# Altium schematic sheet 10_FPGA_misc.SchDoc: FPGA misc (power, clocks, config)
size A3; Organization: Lime Microsystems; Address1: Surrey Tech Centre; Address2: Guildford GU2 7YG; Address3: Surrey; Address4: United Kingdom; Revision: v1.4; SheetNumber: 10; SheetTotal: 15
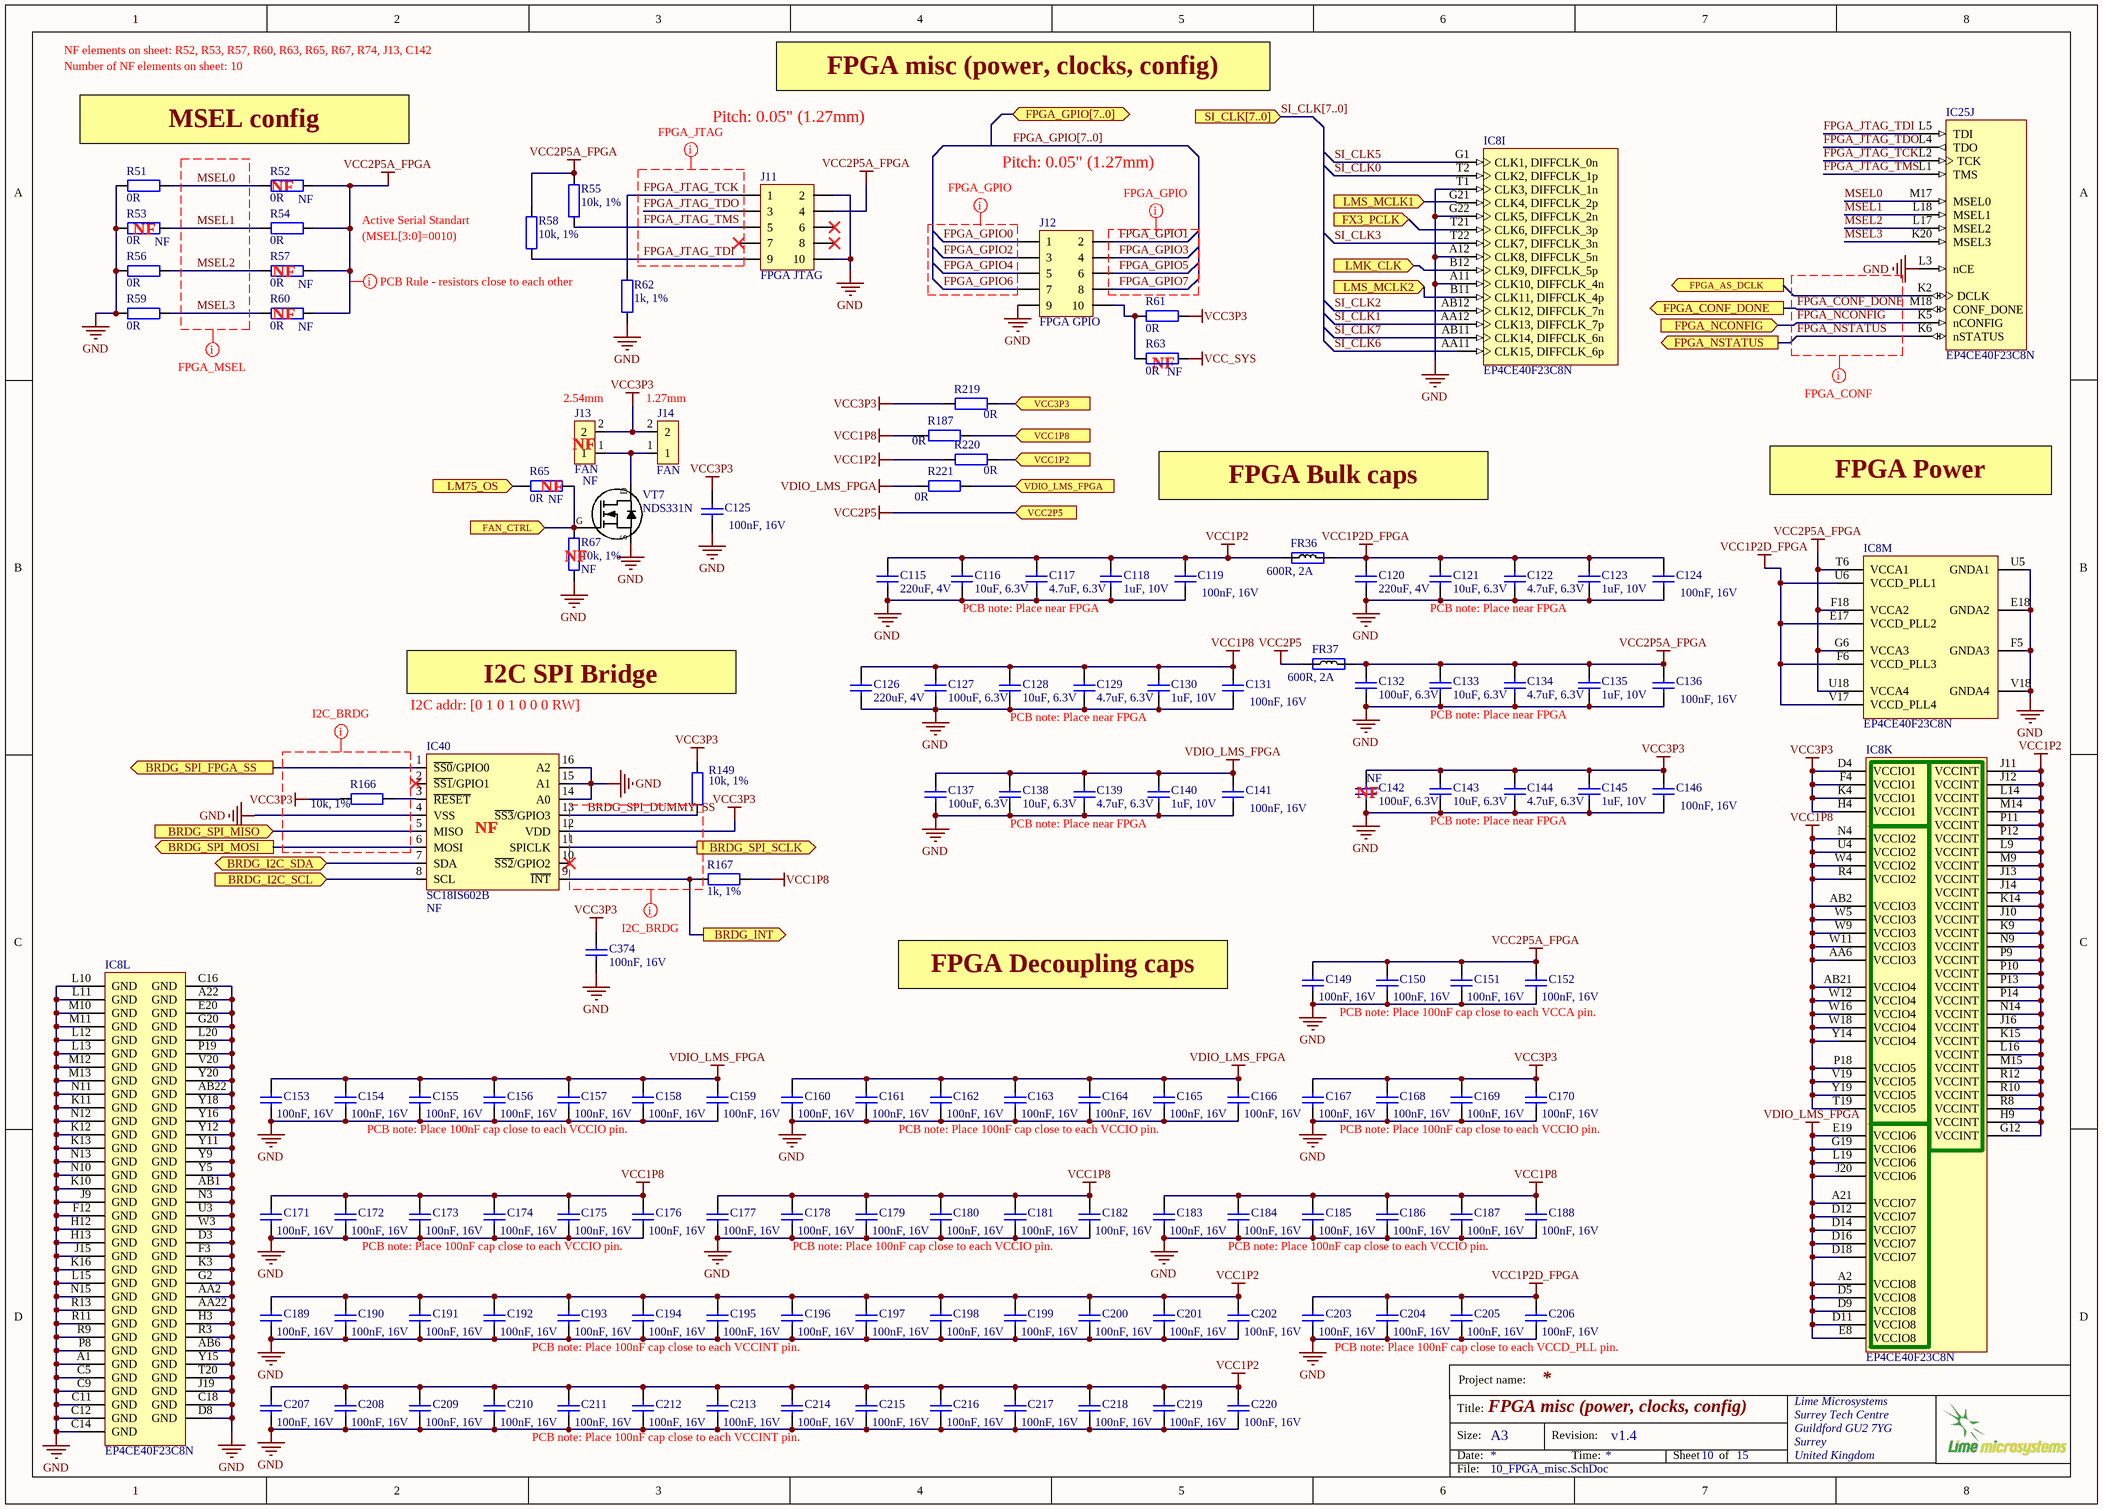
[diagram p0: 10_FPGA_misc.SchDoc]

## Parts
C115  220uF, 4V  [CAP1206]
C116  10uF, 6.3V  [CAP0603]
C117  4.7uF, 6.3V  [CAP0402]
C118  1uF, 10V  [CAP0402]
C119  100nF, 16V  [CAP0402]
C120  220uF, 4V  [CAP1206]
C121  10uF, 6.3V  [CAP0603]
C122  4.7uF, 6.3V  [CAP0402]
C123  1uF, 10V  [CAP0402]
C124  100nF, 16V  [CAP0402]
C125  100nF, 16V  [CAP0402]
C126  220uF, 4V  [CAP1206]
C127  100uF, 6.3V  [CAP1206]
C128  10uF, 6.3V  [CAP0603]
C129  4.7uF, 6.3V  [CAP0402]
C130  1uF, 10V  [CAP0402]
C131  100nF, 16V  [CAP0402]
C132  100uF, 6.3V  [CAP1206]
C133  10uF, 6.3V  [CAP0603]
C134  4.7uF, 6.3V  [CAP0402]
C135  1uF, 10V  [CAP0402]
C136  100nF, 16V  [CAP0402]
C137  100uF, 6.3V  [CAP1206]
C138  10uF, 6.3V  [CAP0603]
C139  4.7uF, 6.3V  [CAP0402]
C140  1uF, 10V  [CAP0402]
C141  100nF, 16V  [CAP0402]
C142  100uF, 6.3V  Assembly Info: NF  [CAP1206]
C143  10uF, 6.3V  [CAP0603]
C144  4.7uF, 6.3V  [CAP0402]
C145  1uF, 10V  [CAP0402]
C146  100nF, 16V  [CAP0402]
C149  100nF, 16V  [CAP0402]
C150  100nF, 16V  [CAP0402]
C151  100nF, 16V  [CAP0402]
C152  100nF, 16V  [CAP0402]
C153  100nF, 16V  [CAP0402]
C154  100nF, 16V  [CAP0402]
C155  100nF, 16V  [CAP0402]
C156  100nF, 16V  [CAP0402]
C157  100nF, 16V  [CAP0402]
C158  100nF, 16V  [CAP0402]
C159  100nF, 16V  [CAP0402]
C160  100nF, 16V  [CAP0402]
C161  100nF, 16V  [CAP0402]
C162  100nF, 16V  [CAP0402]
C163  100nF, 16V  [CAP0402]
C164  100nF, 16V  [CAP0402]
C165  100nF, 16V  [CAP0402]
C166  100nF, 16V  [CAP0402]
C167  100nF, 16V  [CAP0402]
C168  100nF, 16V  [CAP0402]
C169  100nF, 16V  [CAP0402]
C170  100nF, 16V  [CAP0402]
C171  100nF, 16V  [CAP0402]
C172  100nF, 16V  [CAP0402]
C173  100nF, 16V  [CAP0402]
C174  100nF, 16V  [CAP0402]
C175  100nF, 16V  [CAP0402]
C176  100nF, 16V  [CAP0402]
C177  100nF, 16V  [CAP0402]
C178  100nF, 16V  [CAP0402]
C179  100nF, 16V  [CAP0402]
C180  100nF, 16V  [CAP0402]
C181  100nF, 16V  [CAP0402]
C182  100nF, 16V  [CAP0402]
C183  100nF, 16V  [CAP0402]
C184  100nF, 16V  [CAP0402]
C185  100nF, 16V  [CAP0402]
C186  100nF, 16V  [CAP0402]
C187  100nF, 16V  [CAP0402]
C188  100nF, 16V  [CAP0402]
C189  100nF, 16V  [CAP0402]
C190  100nF, 16V  [CAP0402]
C191  100nF, 16V  [CAP0402]
C192  100nF, 16V  [CAP0402]
C193  100nF, 16V  [CAP0402]
C194  100nF, 16V  [CAP0402]
C195  100nF, 16V  [CAP0402]
C196  100nF, 16V  [CAP0402]
C197  100nF, 16V  [CAP0402]
C198  100nF, 16V  [CAP0402]
C199  100nF, 16V  [CAP0402]
C200  100nF, 16V  [CAP0402]
C201  100nF, 16V  [CAP0402]
C202  100nF, 16V  [CAP0402]
C203  100nF, 16V  [CAP0402]
C204  100nF, 16V  [CAP0402]
C205  100nF, 16V  [CAP0402]
C206  100nF, 16V  [CAP0402]
C207  100nF, 16V  [CAP0402]
C208  100nF, 16V  [CAP0402]
C209  100nF, 16V  [CAP0402]
C210  100nF, 16V  [CAP0402]
C211  100nF, 16V  [CAP0402]
C212  100nF, 16V  [CAP0402]
C213  100nF, 16V  [CAP0402]
C214  100nF, 16V  [CAP0402]
C215  100nF, 16V  [CAP0402]
C216  100nF, 16V  [CAP0402]
C217  100nF, 16V  [CAP0402]
C218  100nF, 16V  [CAP0402]
C219  100nF, 16V  [CAP0402]
C220  100nF, 16V  [CAP0402]
C374  100nF, 16V  [CAP0402]
FR36  600R, 2A  [RES0805]
FR37  600R, 2A  [RES0805]
IC8  EP4CE40F23C8N  [FBGA484_A-240]  (parts I,K,L,M of 13)
IC25  EP4CE40F23C8N  [FBGA484_A-240]  (part J of 13)
IC40  SC18IS602B  Assembly Info: NF  [SC18IS602B_TSSOP16]
J11  FPGA JTAG  [SWD_10_pin]
J12  FPGA GPIO  [SWD_10_pin]
J13  FAN  Assembly Info: NF  [HDR_1x2]
J14  FAN  [HDR_1x2_HALF_PITCH]
R51  0R  [RES0402]
R52  0R  Assembly Info: NF  [RES0402]
R53  0R  Assembly Info: NF  [RES0402]
R54  0R  [RES0402]
R55  10k, 1%  [RES0402]
R56  0R  [RES0402]
R57  0R  Assembly Info: NF  [RES0402]
R58  10k, 1%  [RES0402]
R59  0R  [RES0402]
R60  0R  Assembly Info: NF  [RES0402]
R61  0R  [RES0402]
R62  1k, 1%  [RES0402]
R63  0R  Assembly Info: NF  [RES0402]
R65  0R  Assembly Info: NF  [RES0402]
R67  10k, 1%  Assembly Info: NF  [RES0402]
R149  10k, 1%  [RES0402]
R166  10k, 1%  [RES0402]
R167  1k, 1%  [RES0402]
R187  0R  [RES0603]
R219  0R  [RES0603]
R220  0R  [RES0603]
R221  0R  [RES0603]
VT7  NDS331N  [SOT23-3]

## Ports
BRDG_I2C_SCL (in), BRDG_I2C_SDA (bidir), BRDG_INT (out), BRDG_SPI_FPGA_SS (out), BRDG_SPI_MISO (in), BRDG_SPI_MOSI (out), BRDG_SPI_SCLK (out), FAN_CTRL (in), FPGA_AS_DCLK (out), FPGA_CONF_DONE (out), FPGA_GPIO[7..0] (bidir), FPGA_NCONFIG (in), FPGA_NSTATUS (out), FX3_PCLK (in), LM75_OS (in), LMK_CLK (in), LMS_MCLK1 (in), LMS_MCLK2 (in), SI_CLK[7..0] (in), VCC1P2 (in), VCC1P8 (in), VCC2P5 (in), VCC3P3 (in), VDIO_LMS_FPGA (in)

## Nets
GND: C115.1 C116.1 C117.1 C118.2 C119.2 C120.1 C121.1 C122.1 C123.2 C124.2 C125.2 C126.1 C127.1 C128.1 C129.1 C130.1 C131.2 C132.1 C133.1 C134.1 C135.1 C136.2 C137.1 C138.1 C139.1 C140.1 C141.2 C142.1 C143.1 C144.1 C145.1 C146.2 C149.2 C150.2 C151.2 C152.2 C153.2 C154.2 C155.2 C156.2 C157.2 C158.2 C159.2 C160.2 C161.2 C162.2 C163.2 C164.2 C165.2 C166.2 C167.2 C168.2 C169.2 C170.2 C171.2 C172.2 C173.2 C174.2 C175.2 C176.2 C177.2 C178.2 C179.2 C180.2 C181.2 C182.2 C183.2 C184.2 C185.2 C186.2 C187.2 C188.2 C189.2 C190.2 C191.2 C192.2 C193.2 C194.2 C195.2 C196.2 C197.2 C198.2 C199.2 C200.2 C201.2 C202.2 C203.2 C204.2 C205.2 C206.2 C207.2 C208.2 C209.2 C210.2 C211.2 C212.2 C213.2 C214.2 C215.2 C216.2 C217.2 C218.2 C219.2 C220.2 C374.2 IC8.A1(GND) IC8.A11(CLK10,_DIFFCLK_4n) IC8.A12(CLK8,_DIFFCLK_5n) IC8.A22(GND) IC8.AA2(GND) IC8.AA22(GND) IC8.AB1(GND) IC8.AB6(GND) IC8.AB22(GND) IC8.C5(GND) IC8.C9(GND) IC8.C11(GND) IC8.C12(GND) IC8.C14(GND) IC8.C16(GND) IC8.C18(GND) IC8.D3(GND) IC8.D8(GND) IC8.E18(GNDA2) IC8.E20(GND) IC8.F3(GND) IC8.F5(GNDA3) IC8.F12(GND) IC8.G2(GND) IC8.G20(GND) IC8.G22(CLK5,_DIFFCLK_2n) IC8.H3(GND) IC8.H12(GND) IC8.H13(GND) IC8.J9(GND) IC8.J15(GND) IC8.J19(GND) IC8.K3(GND) IC8.K10(GND) IC8.K11(GND) IC8.K12(GND) IC8.K13(GND) IC8.K16(GND) IC8.L10(GND) IC8.L11(GND) IC8.L12(GND) IC8.L13(GND) IC8.L15(GND) IC8.L20(GND) IC8.M10(GND) IC8.M11(GND) IC8.M12(GND) IC8.M13(GND) IC8.N3(GND) IC8.N10(GND) IC8.N11(GND) IC8.N12(GND) IC8.N13(GND) IC8.N15(GND) IC8.P8(GND) IC8.P19(GND) IC8.R3(GND) IC8.R9(GND) IC8.R11(GND) IC8.R13(GND) IC8.T1(CLK3,_DIFFCLK_1n) IC8.T20(GND) IC8.U3(GND) IC8.U5(GNDA1) IC8.V18(GNDA4) IC8.V20(GND) IC8.W3(GND) IC8.Y5(GND) IC8.Y9(GND) IC8.Y11(GND) IC8.Y12(GND) IC8.Y15(GND) IC8.Y16(GND) IC8.Y18(GND) IC8.Y20(GND) IC25.L3(nCE) IC40.4(VSS) IC40.14(A0) IC40.15(A1) IC40.16(A2) J11.2 J11.10 J12.9 R51.2 R53.2 R56.2 R59.2 R62.2 R67.2 VT7.S
VCC1P2: C115.2 C116.2 C117.2 C118.1 C119.1 C189.1 C190.1 C191.1 C192.1 C193.1 C194.1 C195.1 C196.1 C197.1 C198.1 C199.1 C200.1 C201.1 C202.1 C207.1 C208.1 C209.1 C210.1 C211.1 C212.1 C213.1 C214.1 C215.1 C216.1 C217.1 C218.1 C219.1 C220.1 FR36.1 IC8.G12(VCCINT) IC8.H9(VCCINT) IC8.J10(VCCINT) IC8.J11(VCCINT) IC8.J12(VCCINT) IC8.J13(VCCINT) IC8.J14(VCCINT) IC8.J16(VCCINT) IC8.K9(VCCINT) IC8.K14(VCCINT) IC8.K15(VCCINT) IC8.L9(VCCINT) IC8.L14(VCCINT) IC8.L16(VCCINT) IC8.M9(VCCINT) IC8.M14(VCCINT) IC8.M15(VCCINT) IC8.N9(VCCINT) IC8.N14(VCCINT) IC8.P9(VCCINT) IC8.P10(VCCINT) IC8.P11(VCCINT) IC8.P12(VCCINT) IC8.P13(VCCINT) IC8.P14(VCCINT) IC8.R8(VCCINT) IC8.R10(VCCINT) IC8.R12(VCCINT) R220.1
VCC1P2D_FPGA: C120.2 C121.2 C122.2 C123.1 C124.1 C203.1 C204.1 C205.1 C206.1 FR36.2 IC8.E17(VCCD_PLL2) IC8.F6(VCCD_PLL3) IC8.U6(VCCD_PLL1) IC8.V17(VCCD_PLL4)
VCC1P8: C126.2 C127.2 C128.2 C129.2 C130.2 C131.1 C171.1 C172.1 C173.1 C174.1 C175.1 C176.1 C177.1 C178.1 C179.1 C180.1 C181.1 C182.1 C183.1 C184.1 C185.1 C186.1 C187.1 C188.1 IC8.AA6(VCCIO3) IC8.AB2(VCCIO3) IC8.AB21(VCCIO4) IC8.N4(VCCIO2) IC8.P18(VCCIO5) IC8.R4(VCCIO2) IC8.T19(VCCIO5) IC8.U4(VCCIO2) IC8.V19(VCCIO5) IC8.W4(VCCIO2) IC8.W5(VCCIO3) IC8.W9(VCCIO3) IC8.W11(VCCIO3) IC8.W12(VCCIO4) IC8.W16(VCCIO4) IC8.W18(VCCIO4) IC8.Y14(VCCIO4) IC8.Y19(VCCIO5) R167.2 R187.1
VCC2P5: FR37.1 ; port VCC2P5
VCC2P5A_FPGA: C132.2 C133.2 C134.2 C135.2 C136.1 C149.1 C150.1 C151.1 C152.1 FR37.2 IC8.F18(VCCA2) IC8.G6(VCCA3) IC8.T6(VCCA1) IC8.U18(VCCA4) J11.4 R52.1 R54.1 R55.2 R57.1 R58.2 R60.1
VCC3P3: C125.1 C142.2 C143.2 C144.2 C145.2 C146.1 C167.1 C168.1 C169.1 C170.1 C374.1 IC8.D4(VCCIO1) IC8.F4(VCCIO1) IC8.H4(VCCIO1) IC8.K4(VCCIO1) IC40.12(VDD) J13.2 J14.2 R61.1 R149.2 R166.1 R219.1
VCC_SYS: R63.1
VDIO_LMS_FPGA: C137.2 C138.2 C139.2 C140.2 C141.1 C153.1 C154.1 C155.1 C156.1 C157.1 C158.1 C159.1 C160.1 C161.1 C162.1 C163.1 C164.1 C165.1 C166.1 IC8.A2(VCCIO8) IC8.A21(VCCIO7) IC8.D5(VCCIO8) IC8.D9(VCCIO8) IC8.D11(VCCIO8) IC8.D12(VCCIO7) IC8.D14(VCCIO7) IC8.D16(VCCIO7) IC8.D18(VCCIO7) IC8.E8(VCCIO8) IC8.E19(VCCIO6) IC8.G19(VCCIO6) IC8.J20(VCCIO6) IC8.L19(VCCIO6) R221.1
BRDG_I2C_SCL: IC40.8(SCL) ; port BRDG_I2C_SCL
BRDG_I2C_SDA: IC40.7(SDA) ; port BRDG_I2C_SDA
BRDG_INT: IC40.9(~{INT}) R167.1 ; port BRDG_INT
BRDG_SPI_DUMMY_SS: IC40.13(~{SS3}/GPIO3) R149.1
BRDG_SPI_FPGA_SS: IC40.1(~{SS0}/GPIO0) ; port BRDG_SPI_FPGA_SS
BRDG_SPI_MISO: IC40.5(MISO) ; port BRDG_SPI_MISO
BRDG_SPI_MOSI: IC40.6(MOSI) ; port BRDG_SPI_MOSI
BRDG_SPI_SCLK: IC40.11(SPICLK) ; port BRDG_SPI_SCLK
FAN_CTRL: R65.2 R67.1 VT7.G ; port FAN_CTRL
FPGA_AS_DCLK: IC25.K2(DCLK) ; port FPGA_AS_DCLK
FPGA_CONF_DONE: IC25.M18(CONF_DONE) ; port FPGA_CONF_DONE
FPGA_GPIO0: J12.1
FPGA_GPIO1: J12.2
FPGA_GPIO2: J12.3
FPGA_GPIO3: J12.4
FPGA_GPIO4: J12.5
FPGA_GPIO5: J12.6
FPGA_GPIO6: J12.7
FPGA_GPIO7: J12.8
FPGA_JTAG_TCK: IC25.L2(TCK) J11.1 R62.1
FPGA_JTAG_TDI: IC25.L5(TDI) J11.9 R58.1
FPGA_JTAG_TDO: IC25.L4(TDO) J11.3
FPGA_JTAG_TMS: IC25.L1(TMS) J11.5 R55.1
FPGA_NCONFIG: IC25.K5(nCONFIG) ; port FPGA_NCONFIG
FPGA_NSTATUS: IC25.K6(nSTATUS) ; port FPGA_NSTATUS
FX3_PCLK: IC8.T21(CLK6,_DIFFCLK_3p) ; port FX3_PCLK
LM75_OS: R65.1 ; port LM75_OS
LMK_CLK: IC8.B12(CLK9,_DIFFCLK_5p) ; port LMK_CLK
LMS_MCLK1: IC8.G21(CLK4,_DIFFCLK_2p) ; port LMS_MCLK1
LMS_MCLK2: IC8.B11(CLK11,_DIFFCLK_4p) ; port LMS_MCLK2
MSEL0: IC25.M17(MSEL0) R51.1 R52.2
MSEL1: IC25.L18(MSEL1) R53.1 R54.2
MSEL2: IC25.L17(MSEL2) R56.1 R57.2
MSEL3: IC25.K20(MSEL3) R59.1 R60.2
SI_CLK0: IC8.T2(CLK2,_DIFFCLK_1p)
SI_CLK1: IC8.AA12(CLK13,_DIFFCLK_7p)
SI_CLK2: IC8.AB12(CLK12,_DIFFCLK_7n)
SI_CLK3: IC8.T22(CLK7,_DIFFCLK_3n)
SI_CLK5: IC8.G1(CLK1,_DIFFCLK_0n)
SI_CLK6: IC8.AA11(CLK15,_DIFFCLK_6p)
SI_CLK7: IC8.AB11(CLK14,_DIFFCLK_6n)
VCC1P2: R220.2 ; port VCC1P2  [a separate net that carries the same name]
VCC1P8: R187.2 ; port VCC1P8  [a separate net that carries the same name]
VCC3P3: R219.2 ; port VCC3P3  [a separate net that carries the same name]
VDIO_LMS_FPGA: R221.2 ; port VDIO_LMS_FPGA  [a separate net that carries the same name]
NetIC40_3: IC40.3(~{RES}~{ET}) R166.2
NetJ12_10: J12.10 R61.2 R63.2
NetJ13_1: J13.1 J14.1 VT7.D

Not connected (* = marked no-connect by the designer): IC40 2(~{SS1}/GPIO1)* 10(~{SS2}/GPIO2)*; J11 6* 7* 8*

## Buses and harness runs
bus FPGA_GPIO[7..0] = port FPGA_GPIO[7..0]
bus SI_CLK[7..0] = port SI_CLK[7..0]

## Layout directives
rule Undefined: VCC2P5A_FPGA
net class FPGA_MSEL: MSEL0, MSEL1, MSEL2, MSEL3
net class FPGA_GPIO: FPGA_GPIO0, FPGA_GPIO1, FPGA_GPIO2, FPGA_GPIO3, FPGA_GPIO4, FPGA_GPIO5, FPGA_GPIO6, FPGA_GPIO7
net class FPGA_JTAG: FPGA_JTAG_TCK, FPGA_JTAG_TDI, FPGA_JTAG_TDO, FPGA_JTAG_TMS
net class FPGA_CONF: FPGA_CONF_DONE, FPGA_NCONFIG, FPGA_NSTATUS
net class I2C_BRDG: BRDG_SPI_DUMMY_SS, VCC3P3

## Notes on the sheet
- NF elements on sheet: R52, R53, R57, R60, R63, R65, R67, R74, J13, C142
- Number of NF elements on sheet: 10
- FPGA misc (power, clocks, config)
- MSEL config
- Pitch: 0.05" (1.27mm)
- (near R53) NF
- (near R52) NF
- Active Serial Standart
- (MSEL[3:0]=0010)
- (near R57) NF
- (near R60) NF
- (near R63) NF
- (near J13) NF
- (near J13) 2.54mm
- (near J14) 1.27mm
- (near R65) NF
- FPGA Bulk caps
- FPGA Power
- (near R67) NF
- PCB note: Place near FPGA
- I2C SPI Bridge
- (near IC40) I2C addr: [0 1 0 1 0 0 0 RW]
- (near IC40) NF
- (near C142) NF
- FPGA Decoupling caps
- PCB note: Place 100nF cap close to each VCCA pin.
- PCB note: Place 100nF cap close to each VCCIO pin.
- PCB note: Place 100nF cap close to each VCCINT pin.
- PCB note: Place 100nF cap close to each VCCD_PLL pin.
- Project name:
- Title:
- Size:
- Date:
- A3
- Revision:
- Time:
- Sheet
- of
- File:

## Library data of the parts
C115 C120 C126 = Cap_1206: Manufacturer Part Number: GRM31CR60G227ME11L; Manufacturer: Murata Electronics North America; Part Description: 220µF ±20% 4V X5R Ceramic Capacitor -55°C ~ 85°C Surface Mount, MLCC 1206 (3216 Metric) 0.126" L x 0.063" W (3.20mm x 1.60mm); Capacitance: 220µF; Temperature Coefficient: X5R; Tolerance: ±20%; Package / Case: 1206 (3216 Metric); Supplier 1: Digi-Key; Packaging: Cut Tape (CT); Size / Dimension: 0.126" L x 0.063" W (3.20mm x 1.60mm); Operating Temperature: -55°C ~ 85°C; Voltage - Rated: 4V; Mounting Type: Surface Mount, MLCC; Ratings: -; Supplier Part Number 1: 490-9774-1-ND; Category: Capacitors; Lead Spacing: -; Lead Style: -; Applications: General Purpose; Features: -; Height - Seated (Max): -; Thickness (Max): 0.075" (1.90mm); RoHS: RoHS Compliant; Value: 220uF, 4V; Manufacturer Part Number 1: GRM31CR60G227ME11L
C116 C121 C128 C133 C138 C143 = Cap_0603: Manufacturer Part Number 1: CC0603MRX5R5BB106; Part Description: 10µF ±20% 6.3V X5R Ceramic Capacitor -55°C ~ 85°C Surface Mount, MLCC 0603 (1608 Metric) 0.063" L x 0.031" W (1.60mm x 0.80mm); Manufacturer: Yageo; Capacitance: 10µF; Tolerance: ±20%; Supplier 1: Digi-Key; Supplier Part Number 1: 311-1448-2-ND; Package / Case: 0603 (1608 Metric); Category: Capacitors; Voltage - Rated: 6.3V; Value: 10uF, 6.3V
C117 C122 C129 C134 C139 C144 = Cap_0402: Manufacturer: Murata Electronics North America; Manufacturer Part Number: GRM155R60J475ME87D; Part Description: 4.7µF ±20% 6.3V X5R Ceramic Capacitor -55°C ~ 85°C Surface Mount, MLCC 0402 (1005 Metric) 0.039" L x 0.020" W (1.00mm x 0.50mm); Tolerance: ±20%; Capacitance: 4.7µF; Temperature Coefficient: X5R; Lead Style: -; Ratings: -; Height - Seated (Max): -; Thickness (Max): 0.022" (0.55mm); Voltage - Rated: 6.3V; Packaging: Cut Tape (CT); Lead Spacing: -; Category: Capacitors; Supplier Part Number 1: 490-5408-1-ND; Applications: General Purpose; Operating Temperature: -55°C ~ 85°C; Mounting Type: Surface Mount, MLCC; Features: Derating Recommended; RoHS: RoHS Compliant; Supplier 1: Digi-Key; Package / Case: 0402 (1005 Metric); Size / Dimension: 0.039" L x 0.020" W (1.00mm x 0.50mm); Value: 4.7uF, 6.3V
C118 C123 C130 C135 C140 C145 = Cap_0402: Manufacturer Part Number 1: GRM155R61A105KE15J; Manufacturer: TDK; Part Description: 1µF ±10% 10V X5R Ceramic Capacitor -55°C ~ 85°C Surface Mount, MLCC 0402 (1005 Metric) 0.039" L x 0.020" W (1.00mm x 0.50mm); Voltage Rating: 10; Capacitance Tolerance: ± 10%; Product Range: TDK - C Series; Ceramic Capacitor Case: 0402 [1005 Metric]; Capacitance: 1; Dielectric Characteristic: X6; Value: 1uF, 10V; Supplier 1: Newark; Supplier Part Number 1: 490-6298-2-ND; MSL: -; RoHS: YES
C119 C124 C125 C131 C136 C141 C146 C149-C220 C374 = Cap_0603: Manufacturer Part Number 1: GRM155R71C104KA88D; Part Description: 0.10µF ±10% 16V X7R Ceramic Capacitor -55°C ~ 125°C Surface Mount, MLCC 0402 (1005 Metric) 0.039" L x 0.020" W (1.00mm x 0.50mm); Brand: Murata Electronics; Tolerance: 10 %; Type: General Purpose MLCC; Capacitance: 0.1 uF; Temperature Coefficient / Code: +/- 15 %; Supplier 1: Mouser; Supplier Part Number 1: 81-GRM155R71C104KA88; Case Code - in: 0402; Manufacturer: Murata Electronics; Category: Multilayer Ceramic Capacitors MLCC - SMD/SMT; Voltage Rating DC: 16 V; Value: 100nF, 16V; Manufacturer Part Number: GRM155R71C104KA88D
C127 C132 C137 C142 = Cap_1206: Manufacturer: Murata Electronics North America; Manufacturer Part Number 1: GRM31CR60J107ME39L.; Part Description: 100µF ±20% 6.3V X5R Ceramic Capacitor -55°C ~ 85°C Surface Mount, MLCC 1206 (3216 Metric) 0.126" L x 0.063" W (3.20mm x 1.60mm); Capacitance Tolerance: ± 20%; Ceramic Capacitor Case: 1206 [3216 Metric]; Voltage Rating: 6.3; value: 100uF, 6.3V; Supplier Part Number 1: 1735535; Supplier 1: Farnell
FR36 FR37 = Ferrite: Manufacturer Part Number 1: MPZ2012S601AT000; Manufacturer: TDK Corporation; Part Description: FERRITE BEAD 600 OHM 0805 1LN; Filter Type: Differential Mode - Single; Impedance @ Frequency: 600 Ohm @ 100MHz; DC Resistance (DCR): 100 mOhm Max; Supplier 1: Digi-Key; Supplier Part Number 1: 445-2206-2-ND; Mounting Type: Surface Mount; RoHS: RoHS Compliant; Height (Max): 0.041" (1.05mm); Packaging: Tape & Reel (TR); Category: Filters; Current Rating: 2A; Package / Case: 0805 (2012 Metric); Size / Dimension: 0.079" L x 0.049" W (2.00mm x 1.25mm); Value: 600R, 2A
IC8 IC25 = EP4CE40F23C7N: IC FPGA 328 I/O 484FBGA; Manufacturer: Altera; Number of I/O: 328; Number of LABs/CLBs: 2475; Number of Logic Elements/Cells: 39600; Total RAM Bits: 1161216; Voltage - Supply: 1.15 V ~ 1.25 V; DatasheetVersion: ver1.6, Nov-2011; PackageDescription: 484-Pin FineLine Ball Grid Array (FBGA) - Wire Bond - A:2.40; Code_JEDEC: MS-034-AAJ-1; ComponentLink1Description: Manufacturer URL; ComponentLink1URL: http://www.altera.com/; ComponentLink2Description: Handbook; ComponentLink2URL: http://www.altera.com/literature/hb/cyclone-iv/cyclone4-handbook.pdf; ComponentLink3Description: Pinout; ComponentLink3URL: http://www.altera.com/literature/lit-dp.jsp?category=cyc%204&showspreadsheet=y; ComponentLink4Description: Package Specification; ComponentLink4URL: http://www.altera.com/devicepackaging/04R00247-02.pdf; Category: Integrated Circuits (ICs); Manufacturer Part Number 1: EP4CE40F23C8N; Mounting Type: Surface Mount; Number of Gates: -; Operating Temperature: 0°C ~ 85°C; Package / Case: 484-BGA; RoHS: RoHS Compliant; Supplier 1: Digi-Key; Supplier Device Package: 484-FBGA (23x23); Supplier Part Number 1: 544-2811-ND; Part Description: IC FPGA 328 I/O 484FBGA
IC40 = SC18IS602: Manufacturer Part Number 1: SC18IS602BIPW,112; Manufacturer: NXP Semiconductors; Part Description: IC BRIDGE SPI/I2C 16-TSSOP; Interface: SPI; Voltage - Supply: 2.4 V ~ 3.6 V; Current - Supply: 11mA; Function: Controller; Protocol: I²C; Standards: -; Operating Temperature: -40°C ~ 85°C; RoHS: RoHS Compliant; Packaging: Tube; Category: Integrated Circuits (ICs); Supplier Device Package: 16-TSSOP; Package / Case: 16-TSSOP (0.173", 4.40mm Width); Supplier 1: Digi-Key; Supplier Part Number 1: 568-4785-5-ND
J11 J12 = Header 5X2_SWD: Header, 5-Pin, Dual row; Manufacturer Part Number 1: M50-3600542; Manufacturer: Harwin Inc; Part Description: CONN HDR 1.27MM SMD AU 10POS; Number of Positions: 10; Molding Height Above Board: 0.039" (1.00mm); Row Spacing: 0.050" (1.27mm); Number of Positions Loaded: All; Connector Type: Unshrouded; Supplier 1: Digi-Key; Contact Mating Length: 0.118" (3.00mm); Category: Connectors, Interconnects; Color: Black; RoHS: RoHS Compliant; Number of Rows: 2; Contact Finish Thickness: 3µin (0.08µm); Height Stacking (Mating): -; Contact Finish: Gold; Termination: Solder; Mounting Type: Surface Mount; Pitch: 0.050" (1.27mm); Features: -; Packaging: Bulk; Supplier Part Number 1: 952-1389-ND
J13 = Jumper: Manufacturer Part Number 1: 961102-6404-AR; Part Description: 2 Positions Header, Unshrouded Connector 0.100" (2.54mm) Through Hole Gold; Manufacturer: 3M; Connector Type: Header, Unshrouded; Supplier 1: Digi-Key; Supplier Part Number 1: 3M9447-ND; Contact Type: Male Pin; Color: Black; Mounting Type: Through Hole; Category: Connectors, Interconnects; Contact Finish: Gold
J14 = Jumper: Manufacturer Part Number 1: GRPB021VWVN-RC; Manufacturer: Sullins Connector Solutions; Part Description: CONN SHUNT 1.27MM BLUE W/HANDLE; Connector Type: Header, Unshrouded; Number of Positions: 2; Number of Positions Loaded: All; Pitch: 0.050" (1.27mm); Supplier 1: Digi-Key; Supplier Part Number 1: S9014E-02-ND; Contact Mating Length: 0.118" (3.00mm); Mounting Type: Through Hole; Termination: Solder; Fastening Type: -; Features: -; Contact Finish: Gold; Contact Finish Thickness: Flash; Color: -; Category: Connectors, Interconnects; RoHS: RoHS Compliant; Packaging: Bulk; Contact Type: Male Pin; Number of Rows: 1; Row Spacing: -
R51-R54 R56 R57 R59-R61 R63 R65 = Res_0402: Manufacturer: Yageo; Part Description: RES SMD 0.0OHM JUMPER 1/16W 0402; Supplier 1: Digi-Key; Supplier Part Number 1: 311-0.0JRTR-ND; Composition: Thick Film; Package / Case: 0402 (1005 Metric); Category: Resistors; Value: 0R
R55 R58 R67 R149 R166 = Res_0402: Manufacturer: Yageo; Manufacturer Part Number 1: RC0402FR-0710KL; Part Description: RES SMD 10K OHM 1% 1/16W 0402; Temperature Coefficient: ±100ppm/°C; Power (Watts): 0.063W, 1/16W; Value: 10k, 1%; Supplier 1: Digi-Key; Supplier Part Number 1: 311-10.0KLRTR-ND; Resistance (Ohms): 10k; Packaging: Tape & Reel (TR); RoHS: RoHS Compliant; Package / Case: 0402 (1005 Metric); Tolerance: ±1%; Operating Temperature: -55°C ~ 155°C; Size / Dimension: 0.039" L x 0.020" W (1.00mm x 0.50mm); Number of Terminations: 2; Category: Resistors; Height: 0.016" (0.40mm); Supplier Device Package: 0402; Features: Moisture Resistant; Composition: Thick Film
R62 R167 = Res_0402: Manufacturer: Stackpole Electronics Inc; Manufacturer Part Number 1: RMCF0402FT1K00; Part Description: RES SMD 1K OHM 1% 1/16W 0402; Temperature Coefficient: ±100ppm/°C; Power (Watts): 0.063W, 1/16W; Value: 1k, 1%; Supplier 1: Digi-Key; Supplier Part Number 1: RMCF0402FT1K00TR-ND; Package / Case: 0402 (1005 Metric); Supplier Device Package: 0402; Height: 0.016" (0.40mm); Size / Dimension: 0.039" L x 0.020" W (1.00mm x 0.50mm); Number of Terminations: 2; Packaging: Tape & Reel (TR); Category: Resistors; Composition: Thick Film; Resistance (Ohms): 1k; Tolerance: ±1%; Operating Temperature: -55°C ~ 155°C; RoHS: RoHS Compliant
  R62: Features: Moisture Resistant
  R167: Features: -
R187 R219-R221 = Res_0603: Value: *
VT7 = NDS331N: Part Description: MOSFET N-CH 20V 1.3A SSOT3; Manufacturer: Fairchild Semiconductor; Gate Charge (Qg) @ Vgs: 5nC @ 4.5V; Power - Max: 460mW; Current - Continuous Drain (Id) @ 25°C: 1.3A (Ta); Input Capacitance (Ciss) @ Vds: 162pF @ 10V; FET Type: MOSFET N-Channel, Metal Oxide; Drain to Source Voltage (Vdss): 20V; FET Feature: Logic Level Gate; Supplier Device Package: 3-SSOT; Category: Discrete Semiconductor Products; Mounting Type: Surface Mount; Package / Case: TO-236-3, SC-59, SOT-23-3; Supplier 1: Digi-Key; Supplier Part Number 1: NDS331NCT-ND; Manufacturer Part Number 1: NDS331N